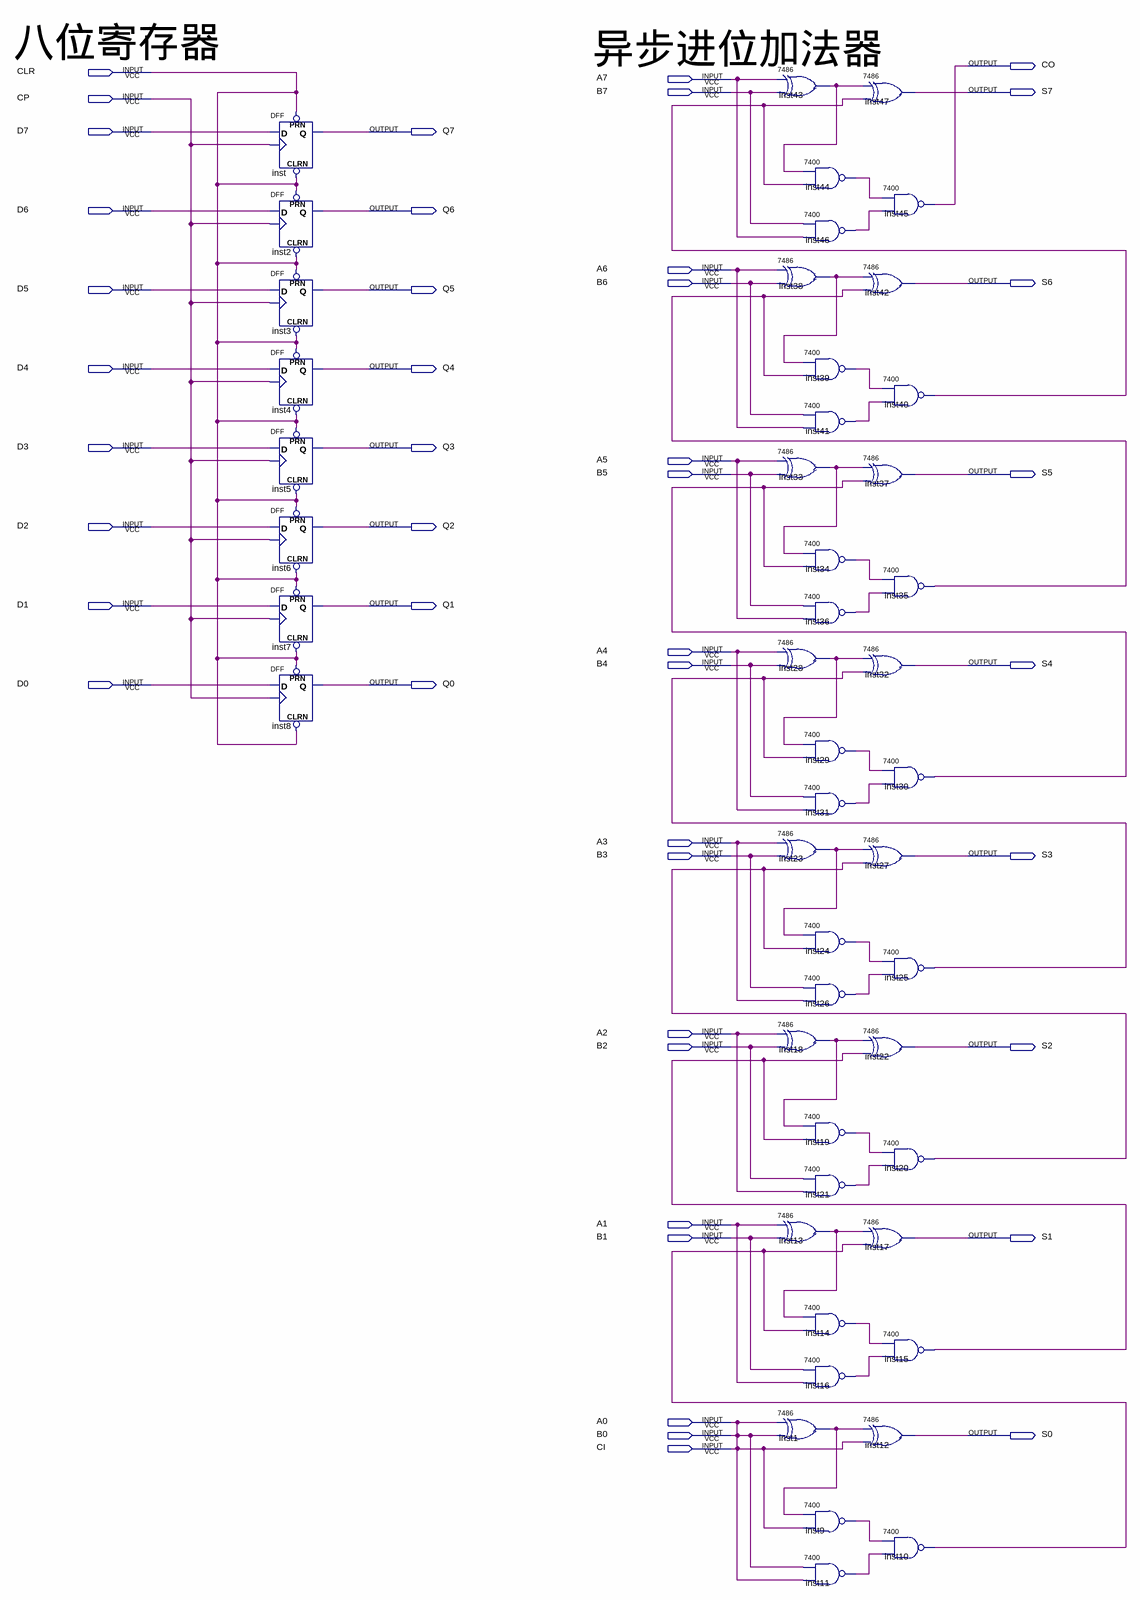
[diagram p0: schematic sheet]
// Quartus schematic print5.bdf as structural Verilog: 48 symbols, 44 pins
module print5 (
  input  CLR,
  input  A7,
  input  B7,
  input  CP,
  input  D7,
  input  D6,
  input  A6,
  input  B6,
  input  D5,
  input  D4,
  input  D3,
  input  A5,
  input  B5,
  input  D2,
  input  D1,
  input  A4,
  input  B4,
  input  D0,
  input  A3,
  input  B3,
  input  A2,
  input  B2,
  input  A1,
  input  B1,
  input  A0,
  input  B0,
  input  CI,
  output CO,
  output S7,
  output Q7,
  output Q6,
  output S6,
  output Q5,
  output Q4,
  output Q3,
  output S5,
  output Q2,
  output Q1,
  output S4,
  output Q0,
  output S3,
  output S2,
  output S1,
  output S0
);

  wire inst1_1, inst9_1, inst10_1, inst11_1, inst13_1, inst14_1, inst15_1, inst16_1, inst18_1, inst19_1,
       inst20_1, inst21_1, inst23_1, inst24_1, inst25_1, inst26_1, inst28_1, inst29_1, inst30_1, inst31_1,
       inst33_1, inst34_1, inst35_1, inst36_1, inst38_1, inst39_1, inst40_1, inst41_1, inst43_1, inst44_1,
       inst46_1;

  DFF inst (.CLRN(CLR), .CLK(CP), .D(D7), .PRN(CLR), .Q(Q7));
  DFF inst2 (.CLRN(CLR), .CLK(CP), .D(D6), .PRN(CLR), .Q(Q6));
  DFF inst3 (.CLRN(CLR), .CLK(CP), .D(D5), .PRN(CLR), .Q(Q5));
  DFF inst4 (.CLRN(CLR), .CLK(CP), .D(D4), .PRN(CLR), .Q(Q4));
  DFF inst5 (.CLRN(CLR), .CLK(CP), .D(D3), .PRN(CLR), .Q(Q3));
  DFF inst6 (.CLRN(CLR), .CLK(CP), .D(D2), .PRN(CLR), .Q(Q2));
  DFF inst7 (.CLRN(CLR), .CLK(CP), .D(D1), .PRN(CLR), .Q(Q1));
  DFF inst8 (.CLRN(CLR), .CLK(CP), .D(D0), .PRN(CLR), .Q(Q0));
  \7486  inst43 (.\2 (A7), .\3 (B7), .\1 (inst43_1));
  \7486  inst38 (.\2 (A6), .\3 (B6), .\1 (inst38_1));
  \7486  inst33 (.\2 (A5), .\3 (B5), .\1 (inst33_1));
  \7486  inst28 (.\2 (A4), .\3 (B4), .\1 (inst28_1));
  \7486  inst23 (.\2 (A3), .\3 (B3), .\1 (inst23_1));
  \7486  inst18 (.\2 (A2), .\3 (B2), .\1 (inst18_1));
  \7486  inst13 (.\2 (A1), .\3 (B1), .\1 (inst13_1));
  \7486  inst1 (.\2 (A0), .\3 (A0), .\1 (inst1_1));
  \7400  inst44 (.\3 (inst40_1), .\2 (inst43_1), .\1 (inst44_1));
  \7400  inst46 (.\3 (A7), .\2 (B7), .\1 (inst46_1));
  \7400  inst39 (.\3 (inst35_1), .\2 (inst38_1), .\1 (inst39_1));
  \7400  inst41 (.\3 (A6), .\2 (B6), .\1 (inst41_1));
  \7400  inst34 (.\3 (inst30_1), .\2 (inst33_1), .\1 (inst34_1));
  \7400  inst36 (.\3 (A5), .\2 (B5), .\1 (inst36_1));
  \7400  inst29 (.\3 (inst25_1), .\2 (inst28_1), .\1 (inst29_1));
  \7400  inst31 (.\3 (A4), .\2 (B4), .\1 (inst31_1));
  \7400  inst24 (.\3 (inst20_1), .\2 (inst23_1), .\1 (inst24_1));
  \7400  inst26 (.\3 (A3), .\2 (B3), .\1 (inst26_1));
  \7400  inst19 (.\3 (inst15_1), .\2 (inst18_1), .\1 (inst19_1));
  \7400  inst21 (.\3 (A2), .\2 (B2), .\1 (inst21_1));
  \7400  inst14 (.\3 (inst10_1), .\2 (inst13_1), .\1 (inst14_1));
  \7400  inst16 (.\3 (A1), .\2 (B1), .\1 (inst16_1));
  \7400  inst9 (.\3 (A0), .\2 (inst1_1), .\1 (inst9_1));
  \7400  inst11 (.\3 (A0), .\2 (A0), .\1 (inst11_1));
  \7486  inst47 (.\2 (inst43_1), .\3 (inst40_1), .\1 (S7));
  \7400  inst45 (.\3 (inst46_1), .\2 (inst44_1), .\1 (CO));
  \7486  inst42 (.\2 (inst38_1), .\3 (inst35_1), .\1 (S6));
  \7400  inst40 (.\3 (inst41_1), .\2 (inst39_1), .\1 (inst40_1));
  \7486  inst37 (.\2 (inst33_1), .\3 (inst30_1), .\1 (S5));
  \7400  inst35 (.\3 (inst36_1), .\2 (inst34_1), .\1 (inst35_1));
  \7486  inst32 (.\2 (inst28_1), .\3 (inst25_1), .\1 (S4));
  \7400  inst30 (.\3 (inst31_1), .\2 (inst29_1), .\1 (inst30_1));
  \7486  inst27 (.\2 (inst23_1), .\3 (inst20_1), .\1 (S3));
  \7400  inst25 (.\3 (inst26_1), .\2 (inst24_1), .\1 (inst25_1));
  \7486  inst22 (.\2 (inst18_1), .\3 (inst15_1), .\1 (S2));
  \7400  inst20 (.\3 (inst21_1), .\2 (inst19_1), .\1 (inst20_1));
  \7486  inst17 (.\2 (inst13_1), .\3 (inst10_1), .\1 (S1));
  \7400  inst15 (.\3 (inst16_1), .\2 (inst14_1), .\1 (inst15_1));
  \7486  inst12 (.\2 (inst1_1), .\3 (A0), .\1 (S0));
  \7400  inst10 (.\3 (inst11_1), .\2 (inst9_1), .\1 (inst10_1));

  assign B0 = A0;
  assign CI = A0;

  // Notes on the sheet:
  //   八位寄存器
  //   异步进位加法器
endmodule
